# EAGLE design MBUS reader through hole (EAGLE 8.2.2)
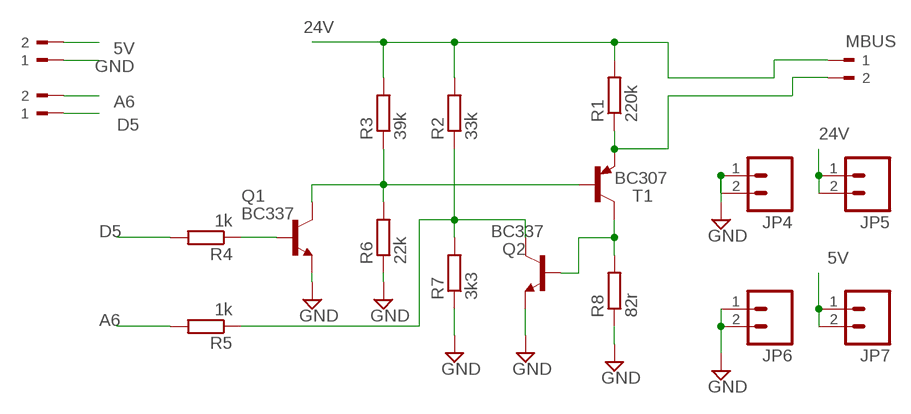
[diagram p0: schematic, sheet 1]

## Parts
JP4  M02PTH  [1X02]
JP5  M02PTH  [1X02]
JP6  M02PTH  [1X02]
JP7  M02PTH  [1X02]
MBUS  180-2  [180-2]
MBUS1  180-2  [180-2]
MBUS2  180-2  [180-2]
Q1  BC337  [TO92]
Q2  BC337  [TO92]
R1  220k  R-EU_0204/7  [0204/7]
R2  33k  R-EU_0204/7  [0204/7]
R3  39k  R-EU_0204/7  [0204/7]
R4  1k  R-EU_0204/7  [0204/7]
R5  1k  R-EU_0204/7  [0204/7]
R6  22k  R-EU_0204/7  [0204/7]
R7  3k3  R-EU_0204/7  [0204/7]
R8  82r  R-EU_0204/7  [0204/7]
T1  BC307  [TO92]

## Nets
5V [power]: JP7.1 JP7.2 MBUS2.2
24V: JP5.1 JP5.2 MBUS.1 R1.2 R2.2 R3.2
A6: MBUS1.2 R5.2
D5: MBUS1.1 R4.2
GND [power]: JP4.1 JP4.2 JP6.1 JP6.2 MBUS2.1 Q1.1(E) Q2.1(E) R6.1 R7.1 R8.1
N$1: MBUS.2 R1.1 T1.1(E)
N$16: Q2.2(B) R8.2 T1.3(C)
N$18: Q1.3(C) R3.1 R6.2 T1.2(B)
N$21: Q2.3(C) R2.1 R5.1 R7.2
N$25: Q1.2(B) R4.1

## Library data of the parts
JP4-JP7 = SparkFun:M02: Header 2 Standard 2-pin 0.1" header. Use with straight break away headers (SKU : PRT-00116), right angle break away headers (PRT-00553), swiss pins (PRT-00743), machine pins (PRT-00117), and female headers (PRT-00115). Molex polarized connector foot print use with SKU : PRT-08233 with associated crimp pins and housings.
MBUS MBUS1 MBUS2 = con-weidmueller-sl35:180-2: WEIDMUELLER CLAMP CONNECTOR; OC_FARNELL: unknown; OC_NEWARK: unknown
Q1 Q2 = transistor:BC337: NPN TRANSISTOR
R1-R8 = resistor:R-EU_: RESISTOR, European symbol
T1 = transistor-pnp:BC307: PNP Transistor

## Net classes
0 default: width 0.203 mm, drill 0.6 mm, clearance 0.203 mm
1 power: width 0.381 mm, drill 0.6 mm, clearance 0.254 mm
2 gnd: width 0.254 mm, drill 0.6 mm, clearance 0.254 mm

## Board
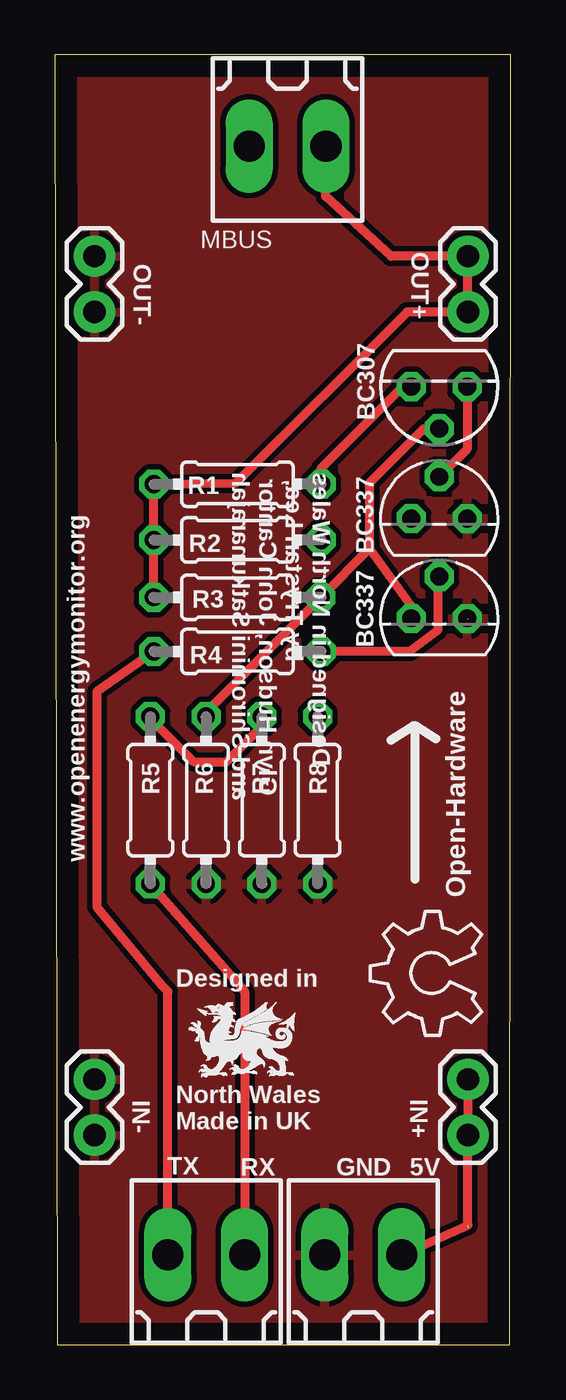
[diagram p1: board, top side]
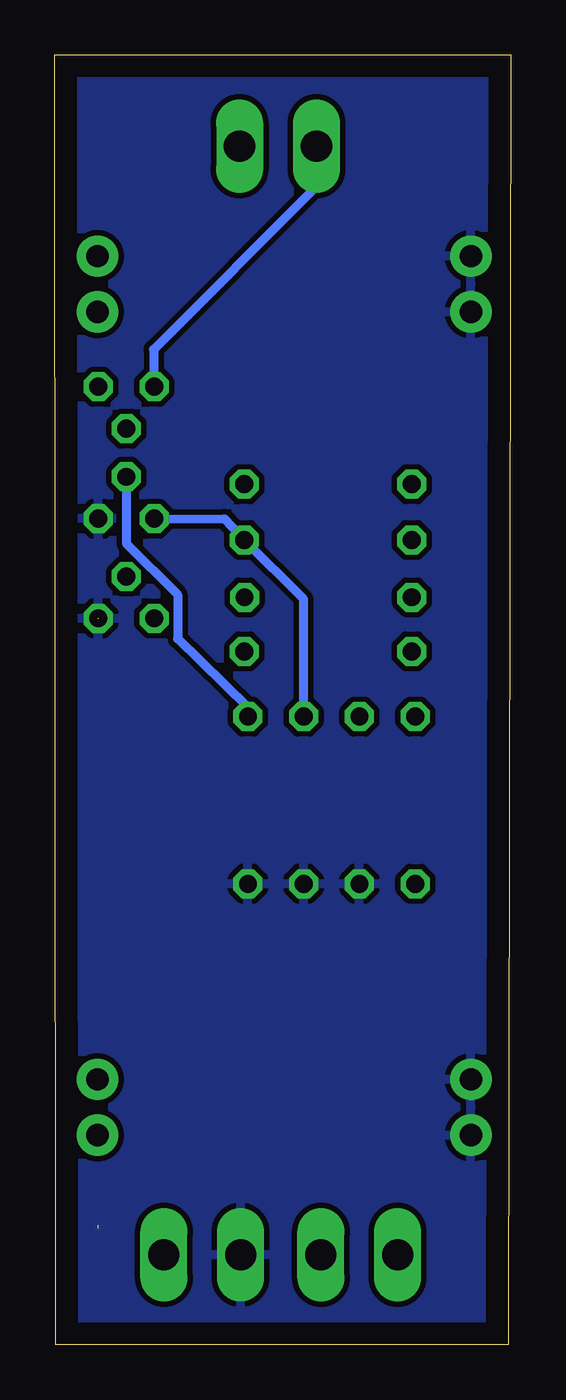
[diagram p2: board, bottom side, seen from below]

Size 20.75 x 58.75 mm. Coordinates in mm from the lower left corner, seen from the top.
Outline: 20.7,0 20.75,58.75 0,58.75 0.1,0 20.7,0
Copper layers (1*16): Top 0.035mm / dielectric 1.5mm / Bottom 0.035mm
Design rules "default *": minimum track width 10mil, minimum drill 24mil, track to track 8mil, track to pad 8mil, pad to pad 8mil, via to via 8mil, smd to smd 8mil, copper to edge 40mil, drill to drill 8mil, minimum pad ring 10mil, minimum via ring 8mil, stop-mask expansion 0.075mm, vias tented up to drill 0.6mm, thermal gap 10mil

### Footprints (pad centres in the part's own frame; a part is rotated, then mirrored left to right if it is on the bottom)
1X02 = drill 1.016 pad 1.88: 1 0,0; 2 2.54,0
180-2 = drill 1.422 long: 1 -1.75,0; 2 1.75,0
TO92 = drill 0.813 octagon: 1 1.27,0; 2 0,1.905; 3 -1.27,0
0204/7 = drill 0.813 octagon: 1 -3.81,0; 2 3.81,0

### Placement (x,y rotation side)
JP4  1.81,47.04 90 top
JP5  18.81,47.04 90 top
JP6  1.81,9.54 90 top
JP7  18.81,9.54 90 top
LOGO1  OSHW_LOGO_6MILX0200-NT  [OSHW_6X200_NOTEXT]  19.43,14.08 90 top
MBUS  10.59,54.59 180 top
MBUS1  6.89,4.09 0 top
MBUS2  14.04,4.09 0 top
Q1  17.5,33.08 0 top
Q2  17.5,37.63 0 top
R1  8.31,39.2 180 top
R2  8.31,36.66 180 top
R3  8.31,34.04 180 top
R4  8.31,31.58 180 top
R5  4.34,24.8 270 top
R6  6.88,24.8 90 top
R7  9.42,24.8 90 top
R8  11.96,24.8 90 top
T1  17.5,43.63 180 top

### Tracks (layer width: path | path; a pad name or v marks a point on that pad's centre or on a via)
5V  (1 unrouted)
  Top 0.406: JP7.2 JP7.1 18.81,5.44 MBUS2.2
24V
  Top 0.406: R3.2 R2.2 R1.2 8.24,39.25 16.03,47.04 JP5.1 JP5.2 15.31,49.58 12.33,52.31 MBUS.1
A6
  Top 0.406: MBUS1.2 8.64,16.09 R5.2
D5
  Top 0.406: 4.81,31.54 4.54,31.54 R4.2 1.91,29.74 1.91,19.94 4.89,16.34 5.14,16.09 MBUS1.1
GND  (1 unrouted)
  Top 0.406: JP4.1 1.78,47.01
  pour Bottom (isolate 0.254): 0.05,46.71 -0.05,26.31 0.1,11.38 0.15,-0.31 21.49,-0.31 21.54,59.66 0.05,59.66
  pour Top (isolate 0.254): 0.05,44.83 0.02,33.7 0.13,9.52 0.1,-0.31 21.59,-0.31 21.69,59.51 0,59.56
N$1
  Top 0.406: R1.1 12.12,39.92 15.83,43.63 T1.1
  Bottom 0.406: MBUS.2 8.85,52.75 16.26,45.34 16.26,43.66 T1.1
N$16
  Top 0.406: T1.3 18.77,40.8 Q2.2
  Bottom 0.406: R8.2 11.96,29.05 15.17,32.16 15.17,34.16 17.5,36.5 Q2.2
N$18
  Top 0.406: 14.31,36.27 14.31,39.24 16.79,41.73 T1.2 | Q1.3 16.26,33.59 14.31,36.27 | R6.2 6.88,28.81 R3.1 14.31,36.27
N$21
  Top 0.406: R7.2 9.31,28.49 9.31,28.04 7.81,26.54 6.33,26.54 4.34,28.53 R5.1 4.31,28.57
  Bottom 0.406: R7.2 9.42,33.96 R2.1 13.03,37.61 Q2.3
N$25
  Top 0.406: Q1.2 17.42,34.91 17.42,32.53 16.17,31.58 R4.1

### Text on the board
tPlace: OUT+ | OUT- | Designed in North Wales / by Trystan Lea, / Glyn Hudson, John Cantor / and Shiromini Satkunarajah | www.openenergymonitor.org | Open-Hardware | Designed in | IN- | North Wales | IN+ | Made in UK | TX | RX | GND | 5V